# EAGLE design USB-Serial (EAGLE 5.04)
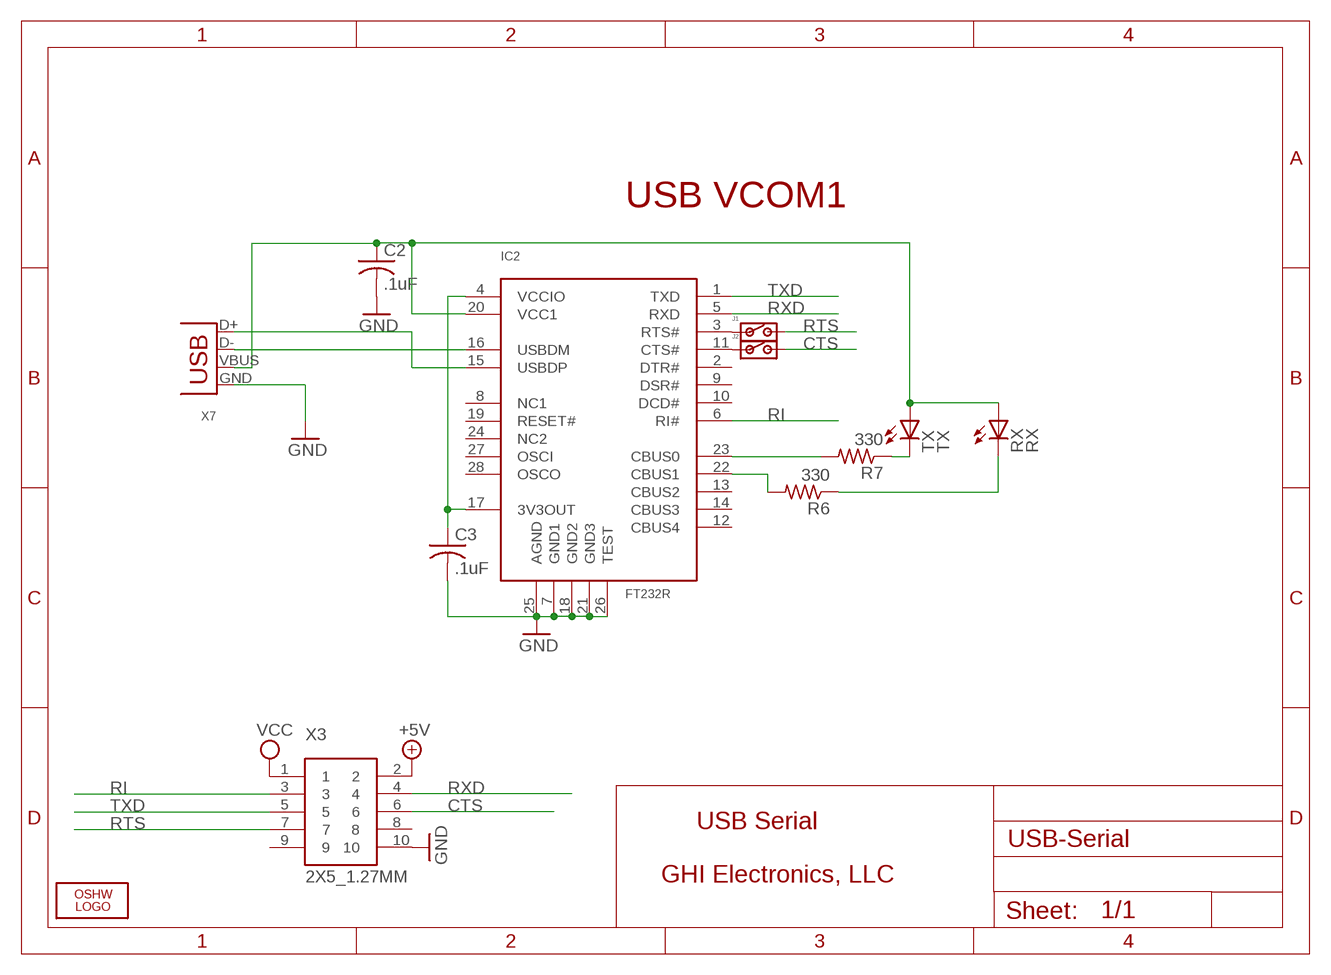
[diagram p0: schematic, sheet 1]

## Parts
C2  .1uF  C-USC0603K  [C0603K]
C3  .1uF  C-USC0603K  [C0603K]
IC2  FT232R  [SSOP28]
J1  do nto connect  JP_SW  [JP_SW]
J2  do nto connect  JP_SW  [JP_SW]
LOGO1  LOGO-OSHW-FILLX0200-NT  [OSHW_FILLX200_NOTEXT]
R6  330  R-US_R0603  [R0603]
R7  330  R-US_R0603  [R0603]
RX  RX  LEDCHIPLED_0805  [CHIPLED_0805]
TX  TX  LEDCHIPLED_0805  [CHIPLED_0805]
X3  2X5_1.27MM  [2X5_1.27MM]
X7  DX2R005HN2E700  USB-MB-S  [USB-MB-S]

## Nets
+5V [power]: X3.2
CTS: J2.2 X3.6
GND [power]: C2.2 C3.2 IC2.7(GND1) IC2.18(GND2) IC2.21(GND3) IC2.25(AGND) IC2.26(TEST) X3.10 X7.GND
N$12: IC2.3(RTS#) J1.1
N$13: IC2.11(CTS#) J2.1
N$44: C3.1 IC2.4(VCCIO) IC2.17(3V3OUT)
N$45: IC2.23(CBUS0) R7.2
N$48: IC2.22(CBUS1) R6.2
N$49: R7.1 TX.C
N$50: R6.1 RX.C
N$51 [power]: C2.1 IC2.20(VCC1) RX.A TX.A X7.VBUS
RI: IC2.6(RI#) X3.3
RTS: J1.2 X3.7
RXD: IC2.5(RXD) X3.4
TXD: IC2.1(TXD) X3.5
U_DBG_USBDM: IC2.16(USBDM) X7.D-
U_DBG_USBDP: IC2.15(USBDP) X7.D+
VCC [power]: X3.1
Unconnected: IC2.2(DTR#) IC2.8(NC1) IC2.9(DSR#) IC2.10(DCD#) IC2.12(CBUS4) IC2.13(CBUS2) IC2.14(CBUS3) IC2.19(RESET#) IC2.24(NC2) IC2.27(OSCI) IC2.28(OSCO) X3.8 X3.9

## Notes on the sheet
- USB VCOM1
- USB Serial
- GHI Electronics, LLC

## Library data of the parts
C2 C3 = rcl:C-US: CAPACITOR, American symbol
IC2 = GHI:FT232R
J1 J2 = CPT_SMD:JP_SW
LOGO1 = Logo:LOGO-OSHW-FILL
R6 R7 = rcl:R-US_: RESISTOR, American symbol
RX TX = led:LED: LED OSRAM: - CHIPLED LG R971, LG N971, LY N971, LG Q971, LY Q971, LO R971, LY R971 LH N974, LH R974 LS Q976, LO Q976, LY Q976 LO Q996 - Hyper CHIPLED LW Q18S LB Q993, LB Q99A, LB R99A - SideLED LS A670, LO A670, LY A670, LG A670, LP A670 LB A673, LV A673, LT A673, LW A673 LH A674 LY A675 LS A676, LA A676, LO A676, LY A676, LW A676 LS A679, LY A679, LG A679 - Hyper Micro SIDELED® LS Y876, LA Y876, LO Y876, LY Y876 LT Y87S - SmartLED LW L88C, LW L88S LB L89C, LB L89S, LG L890 LS L89K, LO L89K, LY L89K LS L896, LA L896, LO L896, LY L896 - TOPLED LS T670, LO T670, LY T670, LG T670, LP T670 LSG T670, LSP T670, LSY T670, LOP T670, LYG T670 LG T671, LOG T671, LSG T671 LB T673, LV T673, LT T673, LW T673 LH T674 LS T676, LA T676, LO T676, LY T676, LB T676, LH T676, LSB T676, LW T676 LB T67C, LV T67C, LT T67C, LS T67K, LO T67K, LY T67K, LW E67C LS E67B, LA E67B, LO E67B, LY E67B, LB E67C, LV E67C, LT E67C LW T67C LS T679, LY T679, LG T679 LS T770, LO T770, LY T770, LG T770, LP T770 LB T773, LV T773, LT T773, LW T773 LH T774 LS E675, LA E675, LY E675, LS T675 LS T776, LA T776, LO T776, LY T776, LB T776 LHGB T686 LT T68C, LB T68C - Hyper Mini TOPLED® LB M676 - Mini TOPLED Santana® LG M470 LS M47K, LO M47K, LY M47K Source: http://www.osram.convergy.de LUXEON: - LUMILED® LXK2-PW12-R00, LXK2-PW12-S00, LXK2-PW14-U00, LXK2-PW14-V00 LXK2-PM12-R00, LXK2-PM12-S00, LXK2-PM14-U00 LXK2-PE12-Q00, LXK2-PE12-R00, LXK2-PE12-S00, LXK2-PE14-T00, LXK2-PE14-U00 LXK2-PB12-K00, LXK2-PB12-L00, LXK2-PB12-M00, LXK2-PB14-N00, LXK2-PB14-P00, LXK2-PB14-Q00 LXK2-PR12-L00, LXK2-PR12-M00, LXK2-PR14-Q00, LXK2-PR14-R00 LXK2-PD12-Q00, LXK2-PD12-R00, LXK2-PD12-S00 LXK2-PH12-R00, LXK2-PH12-S00 LXK2-PL12-P00, LXK2-PL12-Q00, LXK2-PL12-R00 Source: www.luxeon.com KINGBRIGHT: KA-3528ASYC Source: www.kingbright.com
X3 = GHI:2X5_1.27MM
X7 = con-usb-3:USB: USB Connectors

## Net classes
0 default: width 0.254 mm, drill 0.381 mm, clearance 0.203 mm

## Board
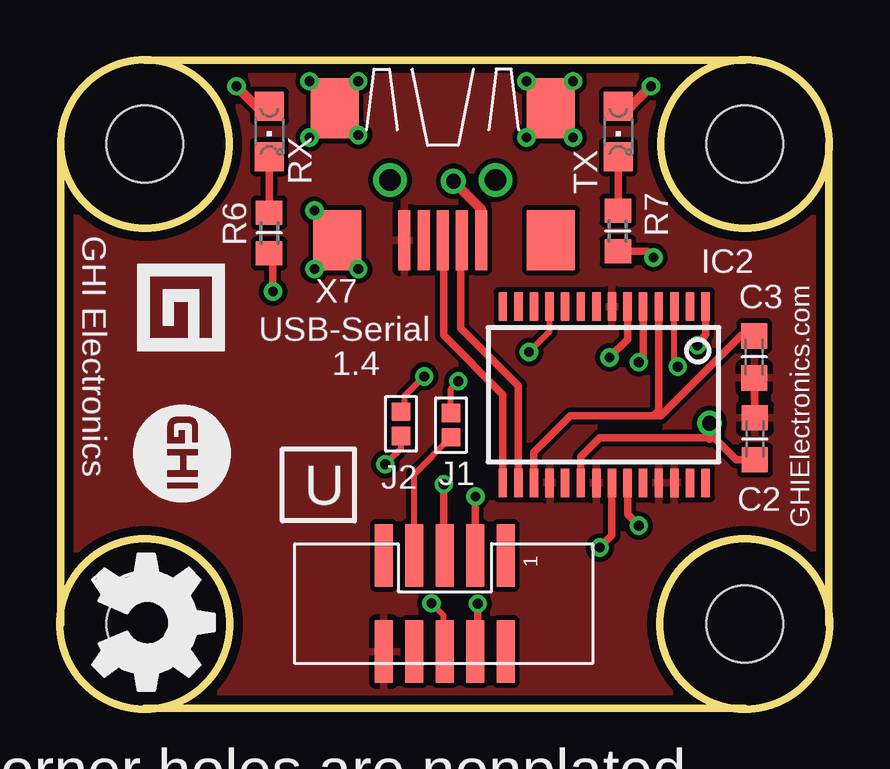
[diagram p1: board, top side]
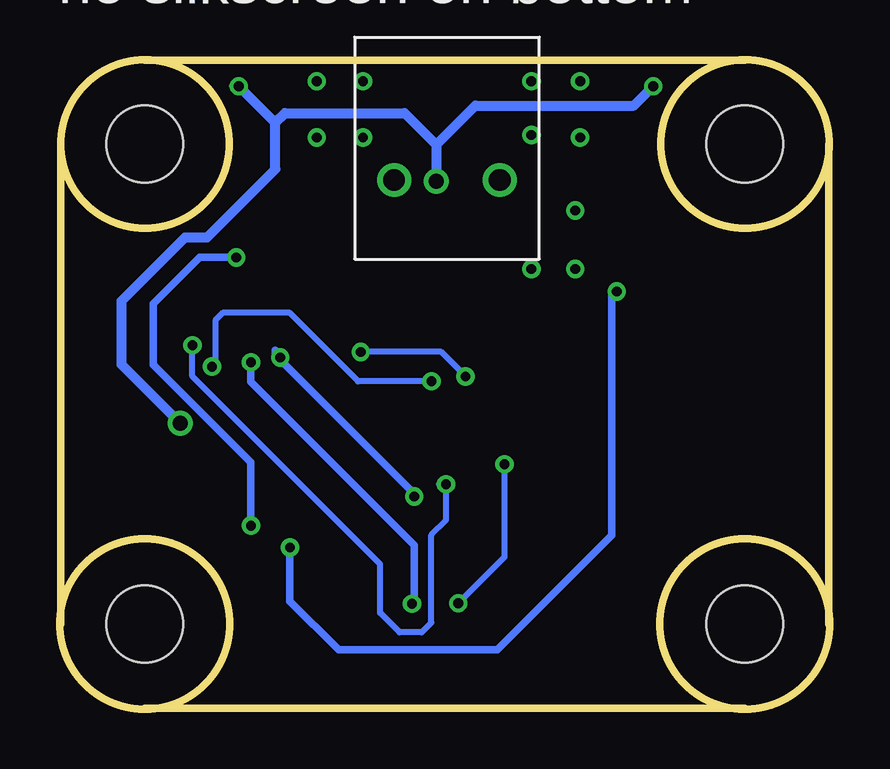
[diagram p2: board, bottom side, seen from below]

Size 32.07 x 27.04 mm. Coordinates in mm from the lower left corner, seen from the top.
Outline: 32.04,3.54 32.04,23.54
Outline: 0.04,23.54 0.04,3.54
Outline: 3.54,27.04 28.54,27.04
Outline: 28.54,0.04 3.54,0.04
Outline: circle at 3.54,23.54 radius 3.5
Outline: circle at 28.54,23.54 radius 3.5
Outline: circle at 28.54,3.54 radius 3.54
Outline: circle at 3.54,3.54 radius 3.54
Copper layers (1+16): Top 0.035mm / dielectric 1.5mm / Bottom 0.035mm
Design rules "default *": minimum track width 8mil, minimum drill 12mil, track to track 8mil, track to pad 8mil, pad to pad 8mil, via to via 8mil, smd to smd 8mil, copper to edge 15mil, drill to drill 8mil, minimum pad ring 10mil, minimum via ring 7mil, stop-mask expansion 4mil, vias tented up to drill 50mil, thermal gap 10mil
Holes 3.2 mm at 3.54,3.54 28.54,23.54 3.54,23.54 28.54,3.54

### Footprints (pad centres in the part's own frame; a part is rotated, then mirrored left to right if it is on the bottom)
C0603K = smd 1.05 x 1.08: 1 -0.875,0; 2 0.875,0
SSOP28 = smd 0.35 x 1.2: 1 -4.255,-3.675; 2 -3.605,-3.675; 3 -2.955,-3.675; 4 -2.305,-3.675; 5 -1.655,-3.675; 6 -1.005,-3.675; 7 -0.355,-3.675; 8 0.295,-3.675; 9 0.945,-3.675; 10 1.595,-3.675; 11 2.245,-3.675; 12 2.895,-3.675; 13 3.545,-3.675; 14 4.195,-3.675; 15 4.195,3.675; 16 3.545,3.675; 17 2.895,3.675; 18 2.245,3.675; 19 1.595,3.675; 20 0.945,3.675; 21 0.295,3.675; 22 -0.355,3.675; 23 -1.005,3.675; 24 -1.655,3.675; 25 -2.305,3.675; 26 -2.955,3.675; 27 -3.605,3.675; 28 -4.255,3.675
JP_SW = smd 0.762 x 0.762: 1 0,0.508; 2 0,-0.508
R0603 = smd 1 x 1.1: 1 -0.85,0; 2 0.85,0
CHIPLED_0805 = smd 1.2 x 1.2: A 0,-1.05; C 0,1.05
2X5_1.27MM = smd 2.6 x 0.74: 1 -2,2.58; 2 2,2.58; 3 -2,1.31; 4 2,1.31; 5 -2,0.04; 6 2,0.04; 7 -2,-1.23; 8 2,-1.23; 9 -2,-2.5; 10 2,-2.5
USB-MB-S = smd 2.5 x 0.5: D+ 2.5,0; D- 2.5,0.8; GND 2.5,-1.6; ID 2.5,-0.8; VBUS 2.5,1.6 | smd 2.5 x 2: P$1 -3,-4.5; P$2 -3,4.5; P$3 2.5,-4.4; P$4 2.5,4.5 | drill 0.9 round: P$5 0,2.2; P$6 0,-2.2

### Placement (x,y rotation side)
C2  28.96,11.25 90 top
C3  28.93,14.66 270 top
IC2  22.64,13.09 180 top
J1  16.29,11.82 0 top
J2  14.21,11.87 0 top
LOGO1  1.36,6.44 270 top
R6  8.71,19.83 270 top
R7  23.24,19.91 270 top
RX  8.72,24.06 180 top
TX  23.26,24.06 180 top
X3  15.99,4.39 270 top
X7  15.95,22.04 270 top

### Tracks (layer width: path | path; a pad name or v marks a point on that pad's centre or on a via)
CTS  (via drill 0.41)
  Top 0.254: J2.2 14.21,10.86 v13.55,10.2 | v15.48,4.4 15.99,3.9 15.99,2.43 X3.6
  Bottom 0.254: v13.55,10.2 13.55,6.33 v15.48,4.4
GND
  Top 0.305: C2.2 28.96,13.76 C3.2
  pour Top: 32.14,27.14 0.34,27.14 0.34,-0.19 32.14,-0.19
N$1  (via drill 0.41)
  other vias: 12.43,23.91
N$2  (via drill 0.41)
  other vias: 10.4,23.81
N$3  (via drill 0.41)
  other vias: 19.44,26.15
N$4  (via drill 0.41)
  other vias: 21.37,26.15
N$5  (via drill 0.41)
  other vias: 21.37,23.81
N$6  (via drill 0.41)
  other vias: 19.44,23.81
N$7  (via drill 0.41)
  other vias: 10.4,26.15
N$8  (via drill 0.41)
  other vias: 12.43,26.15
N$9  (via drill 0.41)
  other vias: 10.6,18.32
N$10  (via drill 0.41)
  other vias: 12.43,18.32
N$11  (via drill 0.41)
  other vias: 10.6,20.76
N$12  (via drill 0.41)
  Top 0.254: J1.1 16.29,13.35 v16.6,13.65 | IC2.3 25.6,14.4 v25.74,14.26
  Bottom 0.254: v16.6,13.65 19.64,13.65 22.49,16.49 25.29,16.49 25.6,16.19 25.6,14.4 v25.74,14.26 25.74,14.36
N$13  (via drill 0.41)
  Top 0.254: IC2.11 20.4,15.72 v19.54,14.87 | v15.17,13.85 14.36,13.04 14.36,12.53 J2.1
  Bottom 0.254: v19.54,14.87 16.19,14.87 v15.17,13.85
N$44
  Top 0.305: IC2.17 19.75,10.68 21.27,12.21 24.72,12.21 | 24.72,12.21 25.03,12.21 28.38,15.56 28.91,15.56 C3.1 | IC2.4 24.95,12.43 24.72,12.21
N$45  (via drill 0.41)
  Top 0.305: R7.2 24.47,19.06 v24.72,18.81 | IC2.23 23.65,8.1 v24.11,7.63
  Bottom 0.305: v24.72,18.81 26.25,18.81 28.18,16.88 28.18,14.34 24.11,10.28 v24.11,7.63
N$48  (via drill 0.41)
  Top 0.305: IC2.22 23,7.23 v22.49,6.72 | v8.87,17.39 8.87,18.82 R6.2
  Bottom 0.305: v22.49,6.72 22.49,4.48 20.46,2.45 13.85,2.45 9.08,7.23 9.08,17.18 v8.87,17.39
N$49
  Top 0.305: TX.C 23.26,20.78 R7.1
N$50
  Top 0.305: RX.C 8.72,20.69 R6.1
N$51  (via drill 0.41, 0.61)
  Top 0.305: IC2.20 21.7,10.5 22.49,11.29 27.06,11.29 27.26,11.29 28.18,10.37 C2.1
  Top 0.406: 27.06,11.29 v27.06,11.9 | X7.VBUS 17.55,20.82 v16.39,21.98 | TX.A 23.79,25.11 v24.62,25.94 | RX.A 8.19,25.11 v7.35,25.94
  Bottom 0.406: v27.06,11.9 29.5,14.34 29.5,17 26.86,19.64 25.94,19.64 23.1,22.49 23.1,24.42 | 16.39,23.51 v16.39,21.98 | 16.39,23.51 17.71,24.83 22.69,24.83 23.1,24.42 | 24.83,25.94 v24.62,25.94 23.1,24.42 | v7.35,25.94 8.16,25.13 14.77,25.13 16.39,23.51
RI  (via drill 0.41)
  Top 0.305: IC2.6 23.65,15.4 v22.9,14.64 | v17.31,8.85 17.31,6.4 X3.3
  Bottom 0.305: v22.9,14.64 23.1,14.95 23.1,14.75 17.31,8.95 v17.31,8.85
RTS
  Top 0.254: X3.7 14.76,9.78 J1.2
RXD  (via drill 0.41)
  Top 0.305: IC2.5 24.3,14.62 v24.11,14.44 | v17.41,4.38 17.41,2.5 X3.4
  Bottom 0.305: v24.11,14.44 24.11,13.63 17.31,6.82 17.31,4.48 v17.41,4.38
TXD  (via drill 0.41)
  Top 0.305: IC2.1 26.9,15.6 v26.55,15.15 | v15.99,9.36 15.99,6.43 X3.5
  Bottom 0.254: 16.27,9.36 v15.99,9.36 15.99,7.86 16.6,7.25 16.6,3.59 17,3.19 17.92,3.19 18.73,4 18.73,6.03 26.55,13.85 v26.55,15.15
U_DBG_USBDM
  Top 0.305: IC2.16 19.1,13.46 16.7,15.86 16.7,19.48 X7.D-
U_DBG_USBDP
  Top 0.305: IC2.15 18.45,13.1 15.99,15.56 15.99,19.5 X7.D+

### Text on the board
tPlace: GHI Electronics | USB-Serial | 1.4 | U | GHIElectronics.com | corner holes are nonplated | black PCB with white text | Do not add manufacturing codes
bPlace: no silkscreen on bottom